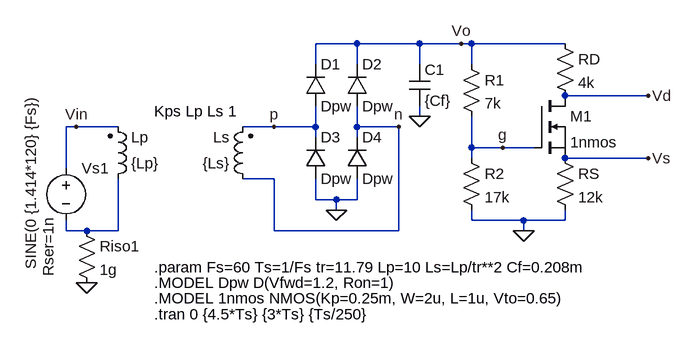
[diagram p0: schematic e2-a-1.asc]
e2-a-1.asc, the LTspice schematic file:
Version 4
SHEET 1 2048 1024
WIRE 1520 256 1456 256
WIRE 1616 256 1520 256
WIRE 1680 256 1616 256
WIRE 1696 256 1680 256
WIRE 1840 256 1696 256
WIRE 1456 288 1456 256
WIRE 1520 288 1520 256
WIRE 1616 288 1616 256
WIRE 1696 288 1696 256
WIRE 1968 336 1840 336
WIRE 1616 368 1616 352
WIRE 1088 384 1072 384
WIRE 1152 384 1088 384
WIRE 1392 384 1344 384
WIRE 1456 384 1456 352
WIRE 1456 384 1392 384
WIRE 1520 384 1520 352
WIRE 1584 384 1520 384
WIRE 1456 400 1456 384
WIRE 1520 400 1520 384
WIRE 1696 416 1696 368
WIRE 1744 416 1696 416
WIRE 1792 416 1744 416
WIRE 1696 432 1696 416
WIRE 1968 432 1840 432
WIRE 1072 448 1072 384
WIRE 1392 464 1344 464
WIRE 1456 496 1456 464
WIRE 1488 496 1456 496
WIRE 1520 496 1520 464
WIRE 1520 496 1488 496
WIRE 1488 512 1488 496
WIRE 1696 528 1696 512
WIRE 1776 528 1696 528
WIRE 1840 528 1840 512
WIRE 1840 528 1776 528
WIRE 1072 544 1072 528
WIRE 1104 544 1072 544
WIRE 1152 544 1152 464
WIRE 1152 544 1104 544
WIRE 1392 544 1392 464
WIRE 1584 544 1584 384
WIRE 1584 544 1392 544
WIRE 1776 544 1776 528
FLAG 1488 512 0
FLAG 1616 368 0
FLAG 1392 384 p
FLAG 1584 384 n
FLAG 1088 384 Vin
FLAG 1104 624 0
FLAG 1680 256 Vo
FLAG 1776 544 0
FLAG 1744 416 g
FLAG 1968 432 Vs
FLAG 1968 336 Vd
SYMBOL voltage 1072 432 R0
WINDOW 123 0 0 Left 0
WINDOW 39 -27 90 VRight 2
WINDOW 3 -54 -98 VRight 2
SYMATTR SpiceLine Rser=1n
SYMATTR Value SINE(0 {1.414*120} {Fs})
SYMATTR InstName Vs1
SYMBOL ind2 1136 480 M180
WINDOW 0 36 80 Left 2
WINDOW 3 36 40 Left 2
SYMATTR InstName Lp
SYMATTR Value {Lp}
SYMATTR Type ind
SYMBOL ind2 1360 480 R180
WINDOW 0 36 80 Left 2
WINDOW 3 36 40 Left 2
SYMATTR InstName Ls
SYMATTR Value {Ls}
SYMATTR Type ind
SYMBOL diode 1440 352 M180
WINDOW 0 24 64 Left 2
WINDOW 3 24 0 Left 2
SYMATTR InstName D1
SYMATTR Value Dpw
SYMBOL diode 1504 352 M180
WINDOW 0 24 64 Left 2
WINDOW 3 24 0 Left 2
SYMATTR InstName D2
SYMATTR Value Dpw
SYMBOL diode 1440 464 M180
WINDOW 0 24 64 Left 2
WINDOW 3 24 0 Left 2
SYMATTR InstName D3
SYMATTR Value Dpw
SYMBOL diode 1504 464 M180
WINDOW 0 24 64 Left 2
WINDOW 3 24 0 Left 2
SYMATTR InstName D4
SYMATTR Value Dpw
SYMBOL cap 1600 288 R0
SYMATTR InstName C1
SYMATTR Value {Cf}
SYMBOL res 1088 528 R0
SYMATTR InstName Riso1
SYMATTR Value 1g
SYMBOL res 1680 272 R0
SYMATTR InstName R1
SYMATTR Value 7k
SYMBOL res 1680 416 R0
SYMATTR InstName R2
SYMATTR Value 17k
SYMBOL res 1824 240 R0
SYMATTR InstName RD
SYMATTR Value 4k
SYMBOL res 1824 416 R0
SYMATTR InstName RS
SYMATTR Value 12k
SYMBOL nmos 1792 336 R0
SYMATTR InstName M1
SYMATTR Value 1nmos
TEXT 1208 600 Left 2 !.param Fs=60 Ts=1/Fs tr=11.79 Lp=10 Ls=Lp/tr**2 Cf=0.208m
TEXT 1208 624 Left 2 !.MODEL Dpw D(Vfwd=1.2, Ron=1)
TEXT 1208 360 Left 2 !Kps Lp Ls 1
TEXT 1208 672 Left 2 !.tran 0 {4.5*Ts} {3*Ts} {Ts/250}
TEXT 1208 648 Left 2 !.MODEL 1nmos NMOS(Kp=0.25m, W=2u, L=1u, Vto=0.65)

The netlist it stands for:
* e2-a-1.asc
Vs1 Vin N001 SINE(0 {1.414*120} {Fs}) Rser=1n
Lp N001 Vin {Lp}
Ls n p {Ls}
D1 p Vo Dpw
D2 n Vo Dpw
D3 0 p Dpw
D4 0 n Dpw
C1 Vo 0 {Cf}
Riso1 N001 0 1g
R1 Vo g 7k
R2 g 0 17k
RD Vo Vd 4k
RS Vs 0 12k
M1 Vd g Vs Vs 1nmos
.model D D
.lib standard.dio
.model NMOS NMOS
.model PMOS PMOS
.lib standard.mos
.param Fs=60 Ts=1/Fs tr=11.79 Lp=10 Ls=Lp/tr**2 Cf=0.208m
.MODEL Dpw D(Vfwd=1.2, Ron=1)
Kps Lp Ls 1
.tran 0 {4.5*Ts} {3*Ts} {Ts/250}
.MODEL 1nmos NMOS(Kp=0.25m, W=2u, L=1u, Vto=0.65)
.backanno
.end

* Results of the author's LTspice run, read from the files saved beside the schematic
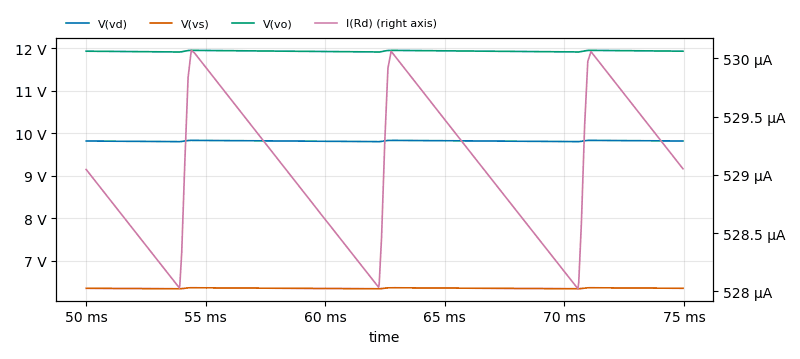
[diagram p1: Transient Analysis of e2-a-1.asc, plotted from the saved traces]
* Transient Analysis, 1 run:
*   V(vd): min 9.803 V, max 9.833 V, average 9.818 V, rms 9.818 V, last 9.818 V
*   V(vs): min 6.336 V, max 6.361 V, average 6.349 V, rms 6.349 V, last 6.348 V
*   V(vo): min 11.91 V, max 11.95 V, average 11.93 V, rms 11.93 V, last 11.93 V
*   I(Rd): min 528 µA, max 530.1 µA, average 529.1 µA, rms 529.1 µA, last 529 µA